# EAGLE design T412_echohello (EAGLE 9.6.2)
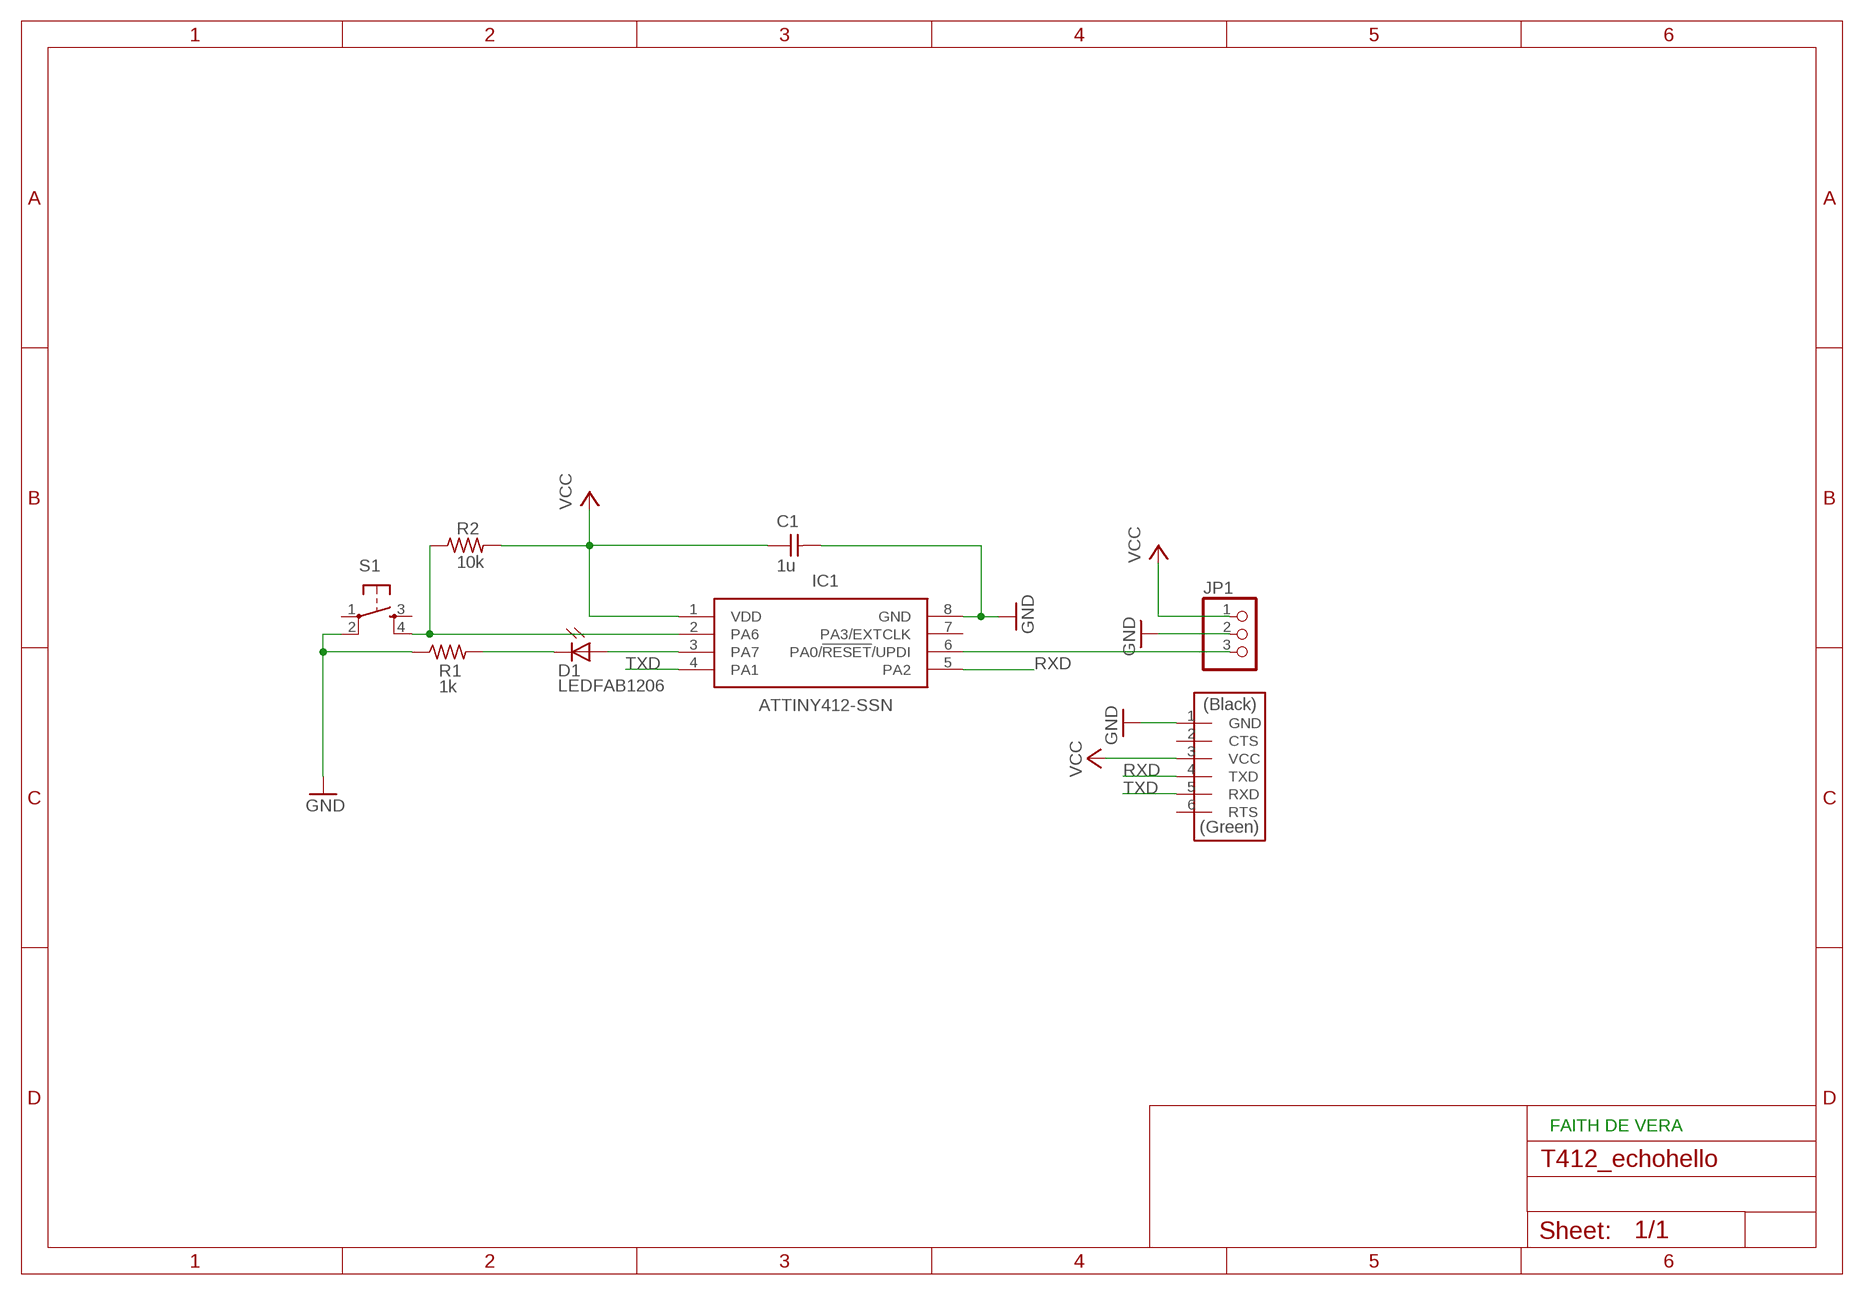
[diagram p0: schematic, sheet 1]

## Parts
C1  1u  CAP_UNPOLARIZEDFAB  [C1206FAB]
D1  LEDFAB1206  [LED1206FAB]
IC1  ATTINY412-SSN  [SOIC127P600X175-8N]
JP1  PINHD-1X3  [1X03]
R1  1k  R1206FAB  [R1206FAB]
R2  10k  R1206FAB  [R1206FAB]
S1  SW_SWITCH_TACTILE_6MM6MM_SWITCH  [6MM_SWITCH]
U$2  CONN_06_FTDI-SMD-HEADER  [1X06SMD]

## Nets
GND: C1.2 IC1.8(GND) JP1.2 R1.1 S1.2(P1) U$2.1(GND)
N$1: D1.1(A) IC1.3(PA7)
N$2: D1.2(C) R1.2
N$3: IC1.2(PA6) R2.1 S1.4(S1)
N$6: IC1.6(PA0/!RESET!/UPDI) JP1.3
RXD: IC1.5(PA2) U$2.4(TXD)
TXD: IC1.4(PA1) U$2.5(RXD)
VCC: C1.1 IC1.1(VDD) JP1.1 R2.2 U$2.3(VCC)
Unconnected: IC1.7(PA3/EXTCLK) S1.1(P) S1.3(S) U$2.2(CTS) U$2.6(RTS)

## Notes on the sheet
- FAITH DE VERA

## Library data of the parts
C1 = fab:CAP_UNPOLARIZED
D1 = fab:LED: LED
IC1 = ATTINY412-SSN:ATTINY412-SSN: 8-bit Microcontrollers - MCU 20MHz, 4KB, SOIC8, Ind 105C, Green, Tube Source: Datasheet <http://www.microchip.com/mymicrochip/filehandler.aspx?ddocname=en599382>; DESCRIPTION: 8-bit Microcontrollers - MCU 20MHz, 4KB, SOIC8, Ind 105C, Green, Tube; HEIGHT: 1.75mm; MANUFACTURER_NAME: Microchip; MANUFACTURER_PART_NUMBER: ATTINY412-SSN; MOUSER_PART_NUMBER: 579-ATTINY412-SSN; MOUSER_PRICE-STOCK: https://www.mouser.co.uk/ProductDetail/Microchip-Technology/ATTINY412-SSN?qs=3HJ2avRr9PItQG9ZsCamPQ%3D%3D
JP1 = pinhead+:PINHD-1X3: PIN HEADER
R1 R2 = fab:R: Resistor (US Symbol) Variants with postfix FAB are widened to allow the routing of internal traces
S1 = fab:SW_SWITCH_TACTILE_6MM: OMRON SWITCH
U$2 = fab:CONN_06_FTDI-SMD-HEADER

## Board
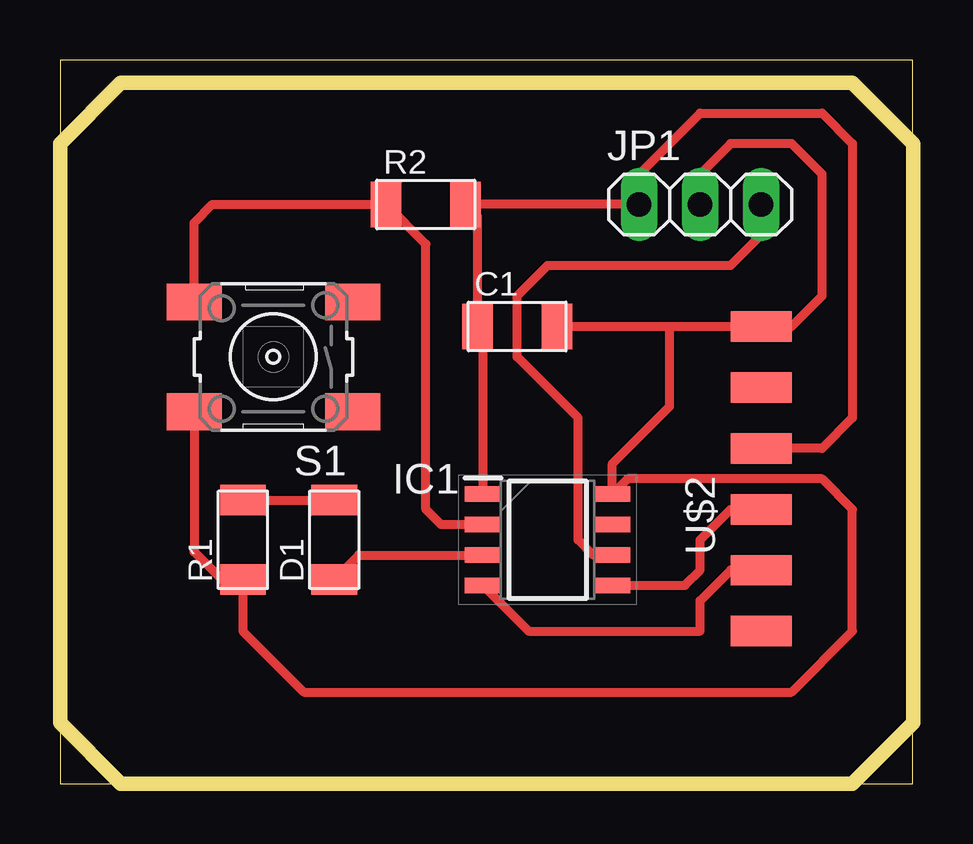
[diagram p1: board, top side]

Size 35.54 x 30.15 mm. Coordinates in mm from the lower left corner, seen from the top.
Outline: 0,0 35.54,0 35.54,30.15 0,30.15 0,0
Copper layers (1*16): Top 0.035mm / dielectric 1.5mm / Bottom 0.035mm
Design rules "default *": minimum track width 15mil, minimum drill 0.35mm, track to track 16mil, track to pad 16mil, pad to pad 16mil, via to via 16mil, smd to smd 12mil, copper to edge 40mil, drill to drill 6mil, minimum pad ring 10mil, minimum via ring 8mil, stop-mask expansion 4mil, vias tented up to drill 0mil, thermal gap 10mil
Milling: 8 lines

### Footprints (pad centres in the part's own frame; a part is rotated, then mirrored left to right if it is on the bottom)
C1206FAB = smd 1.27 x 1.905: 1 -1.651,0; 2 1.651,0
LED1206FAB = smd 1.27 x 1.905: 1 -1.651,0; 2 1.651,0
SOIC127P600X175-8N = smd 1.5 x 0.65: 1 -2.7,1.905; 2 -2.7,0.635; 3 -2.7,-0.635; 4 -2.7,-1.905; 5 2.7,-1.905; 6 2.7,-0.635; 7 2.7,0.635; 8 2.7,1.905
1X03 = drill 1.016 long: 1 -2.54,0; 2 0,0; 3 2.54,0
R1206FAB = smd 1.27 x 1.905: 1 -1.651,0; 2 1.651,0
6MM_SWITCH = smd 2.286 x 1.524: 1 -3.302,2.286; 2 3.302,2.286; 3 -3.302,-2.286; 4 3.302,-2.286
1X06SMD = smd 2.54 x 1.27: 1 0,6.35; 2 0,3.81; 3 0,1.27; 4 0,-1.27; 5 0,-3.81; 6 0,-6.35

### Placement (x,y rotation side)
C1  19.05,19.05 0 top
D1  11.43,10.16 90 top
IC1  20.32,10.16 0 top
JP1  26.67,24.13 0 top
R1  7.62,10.16 90 top
R2  15.24,24.13 0 top
S1  8.89,17.78 180 top
U$2  29.21,12.7 0 top

### Tracks (layer width: path | path; a pad name or v marks a point on that pad's centre or on a via)
GND
  Top 0.381: S1.2 5.59,9.65 6.73,8.51 R1.1 7.62,6.35 10.16,3.81 30.48,3.81 33.02,6.35 33.02,11.43 31.75,12.7 23.66,12.7 IC1.8 23.02,13.34 25.4,15.71 25.4,19.05 | C1.2 25.4,19.05 | 25.4,19.05 U$2.1 30.48,19.05 31.75,20.32 31.75,25.4 30.48,26.67 27.94,26.67 26.67,25.4 JP1.2
N$1
  Top 0.381: D1.1 12.45,9.53 IC1.3
N$2
  Top 0.381: R1.2 D1.2
N$3
  Top 0.381: S1.4 5.59,23.37 6.35,24.13 R2.1 15.24,22.48 15.24,11.43 15.88,10.79 IC1.2
N$6
  Top 0.381: IC1.6 22.23,9.53 21.59,10.16 21.59,15.24 19.05,17.78 19.05,20.32 20.32,21.59 27.94,21.59 29.21,22.86 JP1.3
RXD
  Top 0.381: IC1.5 26.04,8.26 26.67,8.89 26.67,10.16 27.94,11.43 U$2.4
TXD
  Top 0.381: IC1.4 19.52,6.35 26.67,6.35 26.67,7.62 27.94,8.89 U$2.5
VCC
  Top 0.381: U$2.3 31.75,13.97 33.02,15.24 33.02,26.67 31.75,27.94 26.67,27.94 24.13,25.4 JP1.1 R2.2 17.4,23.62 C1.1 17.62,18.83 IC1.1